# Altium schematic sheet Power.SchDoc
size A4
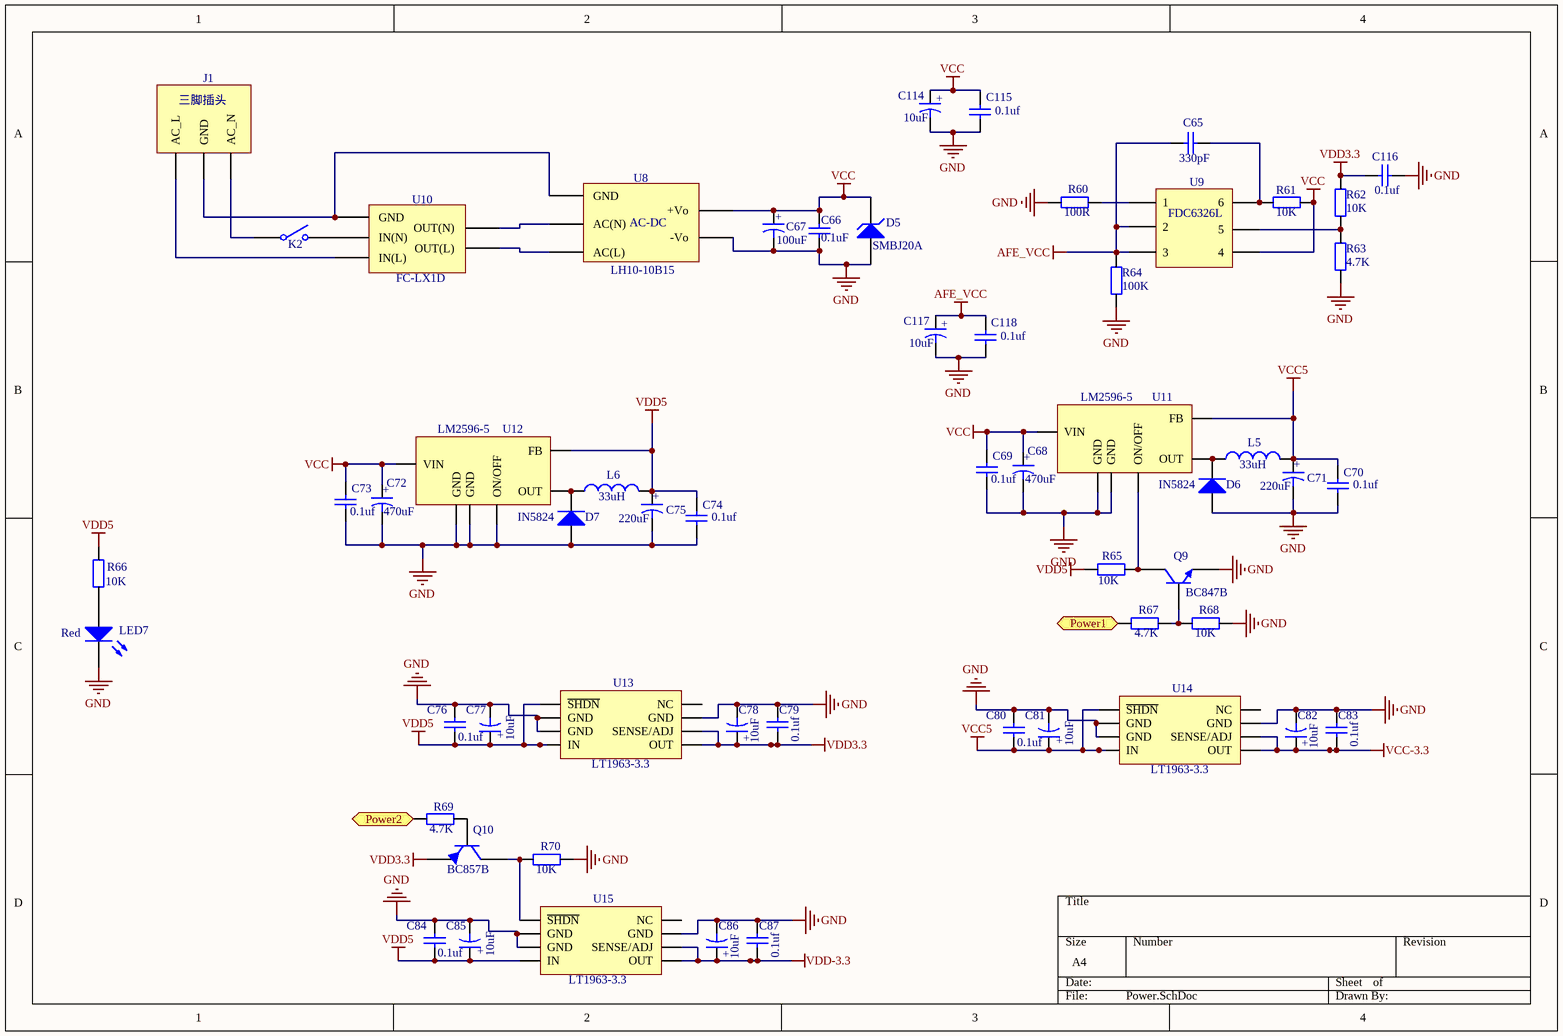
[diagram p0: Power.SchDoc]

## Parts
C65  value 330pF  [0805]  (hidden comment: Capacitor-0805)
C66  value 0.1uF  [0805]  (hidden comment: Capacitor-0805)
C67  value 100uF  [贴片铝电容-8*10.3]  (hidden comment: 电解电容)
C68  value 470uF  [贴片铝电容-10*10]  (hidden comment: 电解电容)
C69  value 0.1uf  [0805]  (hidden comment: Capacitor-0805)
C70  value 0.1uf  [0805]  (hidden comment: Capacitor-0805)
C71  value 220uF  [贴片铝电容-8*10.3]  (hidden comment: 电解电容)
C72  value 470uF  [贴片铝电容-10*10]  (hidden comment: 电解电容)
C73  value 0.1uf  [0805]  (hidden comment: Capacitor-0805)
C74  value 0.1uf  [0805]  (hidden comment: Capacitor-0805)
C75  value 220uF  [贴片铝电容-8*10.3]  (hidden comment: 电解电容)
C76  value 0.1uf  [0805]  (hidden comment: Capacitor-0805)
C77  value 10uF  [钽电容1206（A3216）]  (hidden comment: 电解电容)
C78  value 10uF  [钽电容1206（A3216）]  (hidden comment: 电解电容)
C79  value 0.1uf  [0805]  (hidden comment: Capacitor-0805)
C80  value 0.1uf  [0805]  (hidden comment: Capacitor-0805)
C81  value 10uF  [钽电容1206（A3216）]  (hidden comment: 电解电容)
C82  value 10uF  [钽电容1206（A3216）]  (hidden comment: 电解电容)
C83  value 0.1uf  [0805]  (hidden comment: Capacitor-0805)
C84  value 0.1uf  [0805]  (hidden comment: Capacitor-0805)
C85  value 10uF  [钽电容1206（A3216）]  (hidden comment: 电解电容)
C86  value 10uF  [钽电容1206（A3216）]  (hidden comment: 电解电容)
C87  value 0.1uf  [0805]  (hidden comment: Capacitor-0805)
C114  value 10uF  [3528]  (hidden comment: 电解电容)
C115  value 0.1uf  [0805]  (hidden comment: Capacitor-0805)
C116  value 0.1uf  [0603]  (hidden comment: Capacitor-0805)
C117  value 10uF  [3528]  (hidden comment: 电解电容)
C118  value 0.1uf  [0805]  (hidden comment: Capacitor-0805)
D5  SMBJ20A  [SMBJ20A]
D6  IN5824  [IN5824]
D7  IN5824  [IN5824]
J1  三脚插头  [三芯蛙座]
K2  开关  [T型接头]  (value not drawn)
L5  value 33uH  [SLF6025   电感]  (hidden comment: Inductor)
L6  value 33uH  [SLF6025   电感]  (hidden comment: Inductor)
LED7  Color: Red  [外插小灯]  (hidden comment: LED)
Q9  BC847  [BC847B]  (value not drawn)
Q10  Name: BC857B  [BC847B]  (hidden comment: BC587B)
R60  value 100R  [0603]  (hidden comment: Resistor-0603)
R61  value 10K  [0603]  (hidden comment: Resistor-0603)
R62  value 10K  [0603]  (hidden comment: Resistor-0603)
R63  value 4.7K  [0603]  (hidden comment: Resistor-0603)
R64  value 100K  [0603]  (hidden comment: Resistor-0603)
R65  value 10K  [0603]  (hidden comment: Resistor-0603)
R66  value 10K  [0603]  (hidden comment: Resistor-0603)
R67  value 4.7K  [0603]  (hidden comment: Resistor-0603)
R68  value 10K  [0603]  (hidden comment: Resistor-0603)
R69  value 4.7K  [0603]  (hidden comment: Resistor-0603)
R70  value 10K  [0603]  (hidden comment: Resistor-0603)
U8  Describe: AC-DC  [LH10-10B15]  (hidden comment: LH10-10B15)
U9  FDC6326L  [FDC6326L]
U10  FC-LX1D  [FC-LX1D]
U11  LM2596  [LM2596]  (value not drawn)
U12  LM2596  [LM2596]  (value not drawn)
U13  LT1963  [LT1963]  (value not drawn)
U14  LT1963  [LT1963]  (value not drawn)
U15  LT1963  [LT1963]  (value not drawn)

## Ports
Power1 (in), Power2 (in)

## Nets
AFE_VCC: C65.2 C117.2 C118.2 R64.2 U9.2 U9.3
GND: C66.1 C67.1 C68.1 C69.1 C70.1 C71.1 C72.1 C73.1 C74.1 C75.1 C76.2 C77.1 C78.1 C79.2 C80.2 C81.1 C82.1 C83.2 C84.2 C85.1 C86.1 C87.2 C114.1 C115.1 C116.1 C117.1 C118.1 D5.1(A) D6.1(A) D7.1(A) LED7.2 Q9.1(E) R60.1 R63.1 R64.1 R68.1 R70.1 U8.4(-Vo) U11.3(GND) U11.6(GND) U12.3(GND) U12.5(ON/OFF) U12.6(GND) U13.3(GND) U13.6(GND) U13.7(GND) U14.3(GND) U14.6(GND) U14.7(GND) U15.3(GND) U15.6(GND) U15.7(GND)
VCC: C66.2 C67.2 C68.2 C69.2 C72.2 C73.2 C114.2 C115.2 D5.2(K) R61.1 U8.8(+Vo) U9.4 U11.1(VIN) U12.1(VIN)
VCC5: C70.2 C71.2 C80.1 C81.2 L5.2 U11.4(FB) U14.5(~{SHDN}) U14.8(IN)
VCC-3.3: C82.2 C83.1 U14.1(OUT) U14.2(SENSE/ADJ)
VDD3.3: C78.2 C79.1 C116.2 Q10.1(E) R62.2 U13.1(OUT) U13.2(SENSE/ADJ)
VDD5: C74.2 C75.2 C76.1 C77.2 C84.1 C85.2 L6.2 R65.1 R66.2 U12.4(FB) U13.5(~{SHDN}) U13.8(IN) U15.8(IN)
VDD-3.3: C86.2 C87.1 U15.1(OUT) U15.2(SENSE/ADJ)
Power1: R67.2 ; port Power1
Power2: R69.2 ; port Power2
NetC65_1: C65.1 R61.2 U9.6
NetD6_2: D6.2(K) L5.1 U11.2(OUT)
NetD7_2: D7.2(K) L6.1 U12.2(OUT)
NetJ1_1: J1.1(AC_L) U10.3(IN(L))
NetJ1_2: J1.2(GND) U8.1(GND) U10.1(GND)
NetJ1_3: J1.3(AC_N) K2.1(COMMON)
NetK2_2: K2.2(NO) U10.2(IN(N))
NetLED7_1: LED7.1(A) R66.1
NetQ9_2: Q9.2(B) R67.1 R68.2
NetQ9_3: Q9.3(C) R65.2 U11.5(ON/OFF)
NetQ10_2: Q10.2(B) R69.1
NetQ10_3: Q10.3(C) R70.2 U15.5(~{SHDN})
NetR60_2: R60.2 U9.1
NetR62_1: R62.1 R63.2 U9.5
NetU8_2: U8.2(AC(N)) U10.5(OUT(N))
NetU8_3: U8.3(AC(L)) U10.4(OUT(L))

Not connected (* = marked no-connect by the designer): U13 4(NC); U14 4(NC); U15 4(NC)

## Notes on the sheet
- (in symbol L) LM2596-5; LT1963-3.3
- (in symbol 电解电容) +

## Library data of the parts
C65 C69 C70 C73 C74 C76 C79 C80 C83 C84 C87 C115 C116 C118 = Capacitor
D6 D7 = I
L5 L6 = Ind
U11-U15 = L
D5 = SMBJ20A: Name: SMBJ20A
J1 = 三脚插头: Name: 三脚插头
LED7 = LED: Value: LED
Q9 = BC847: Name: BC847B
U8 = LH10-10B15: Name: LH10-10B15
U9 = FDC6326L: Name: FDC6326L
U10 = FC-LX1D: Name: FC-LX1D